# EAGLE design CANBUS_USB (EAGLE 9.1.3)
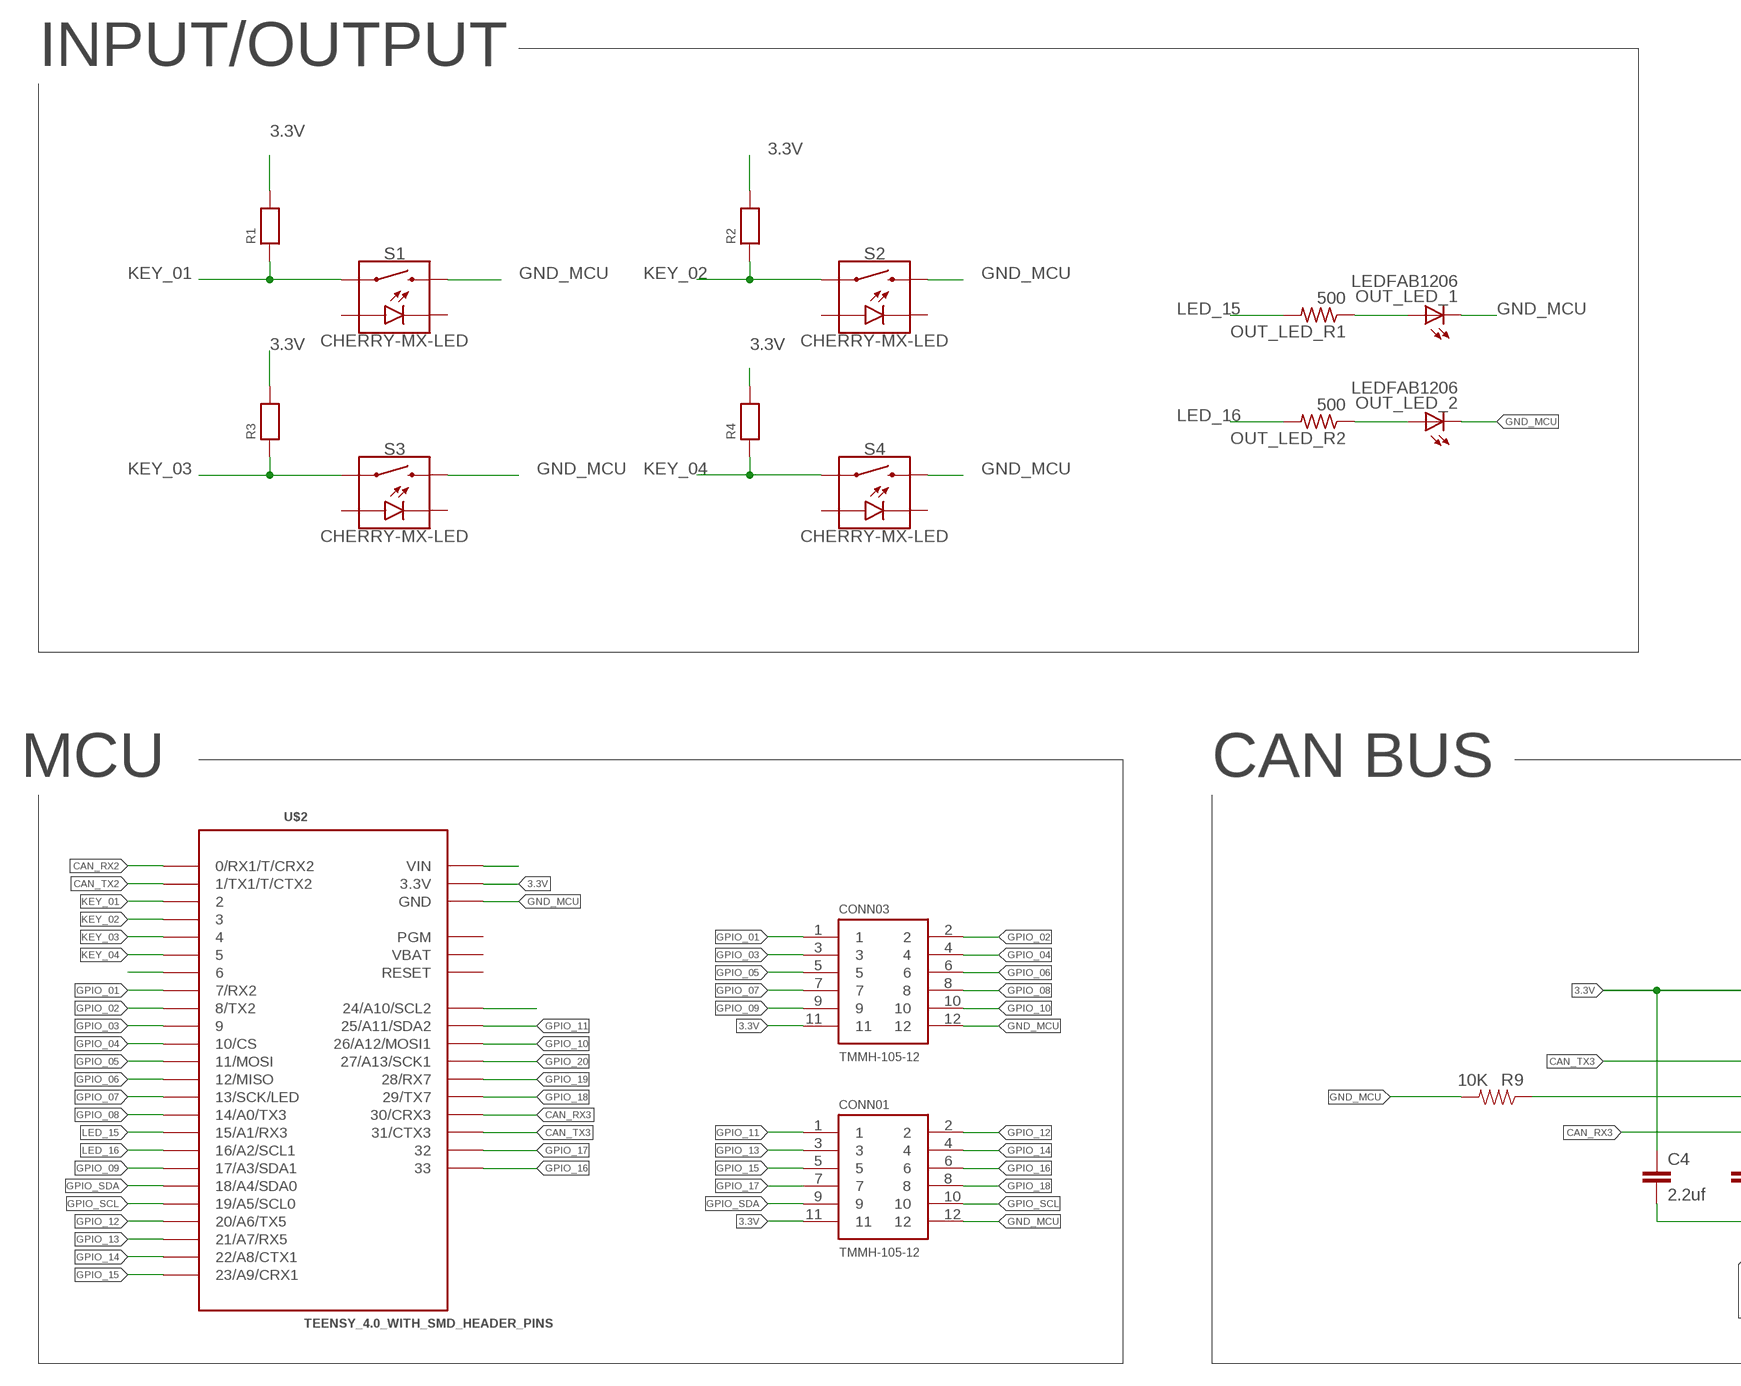
[diagram p0: schematic, sheet 1, part 1 of 2]
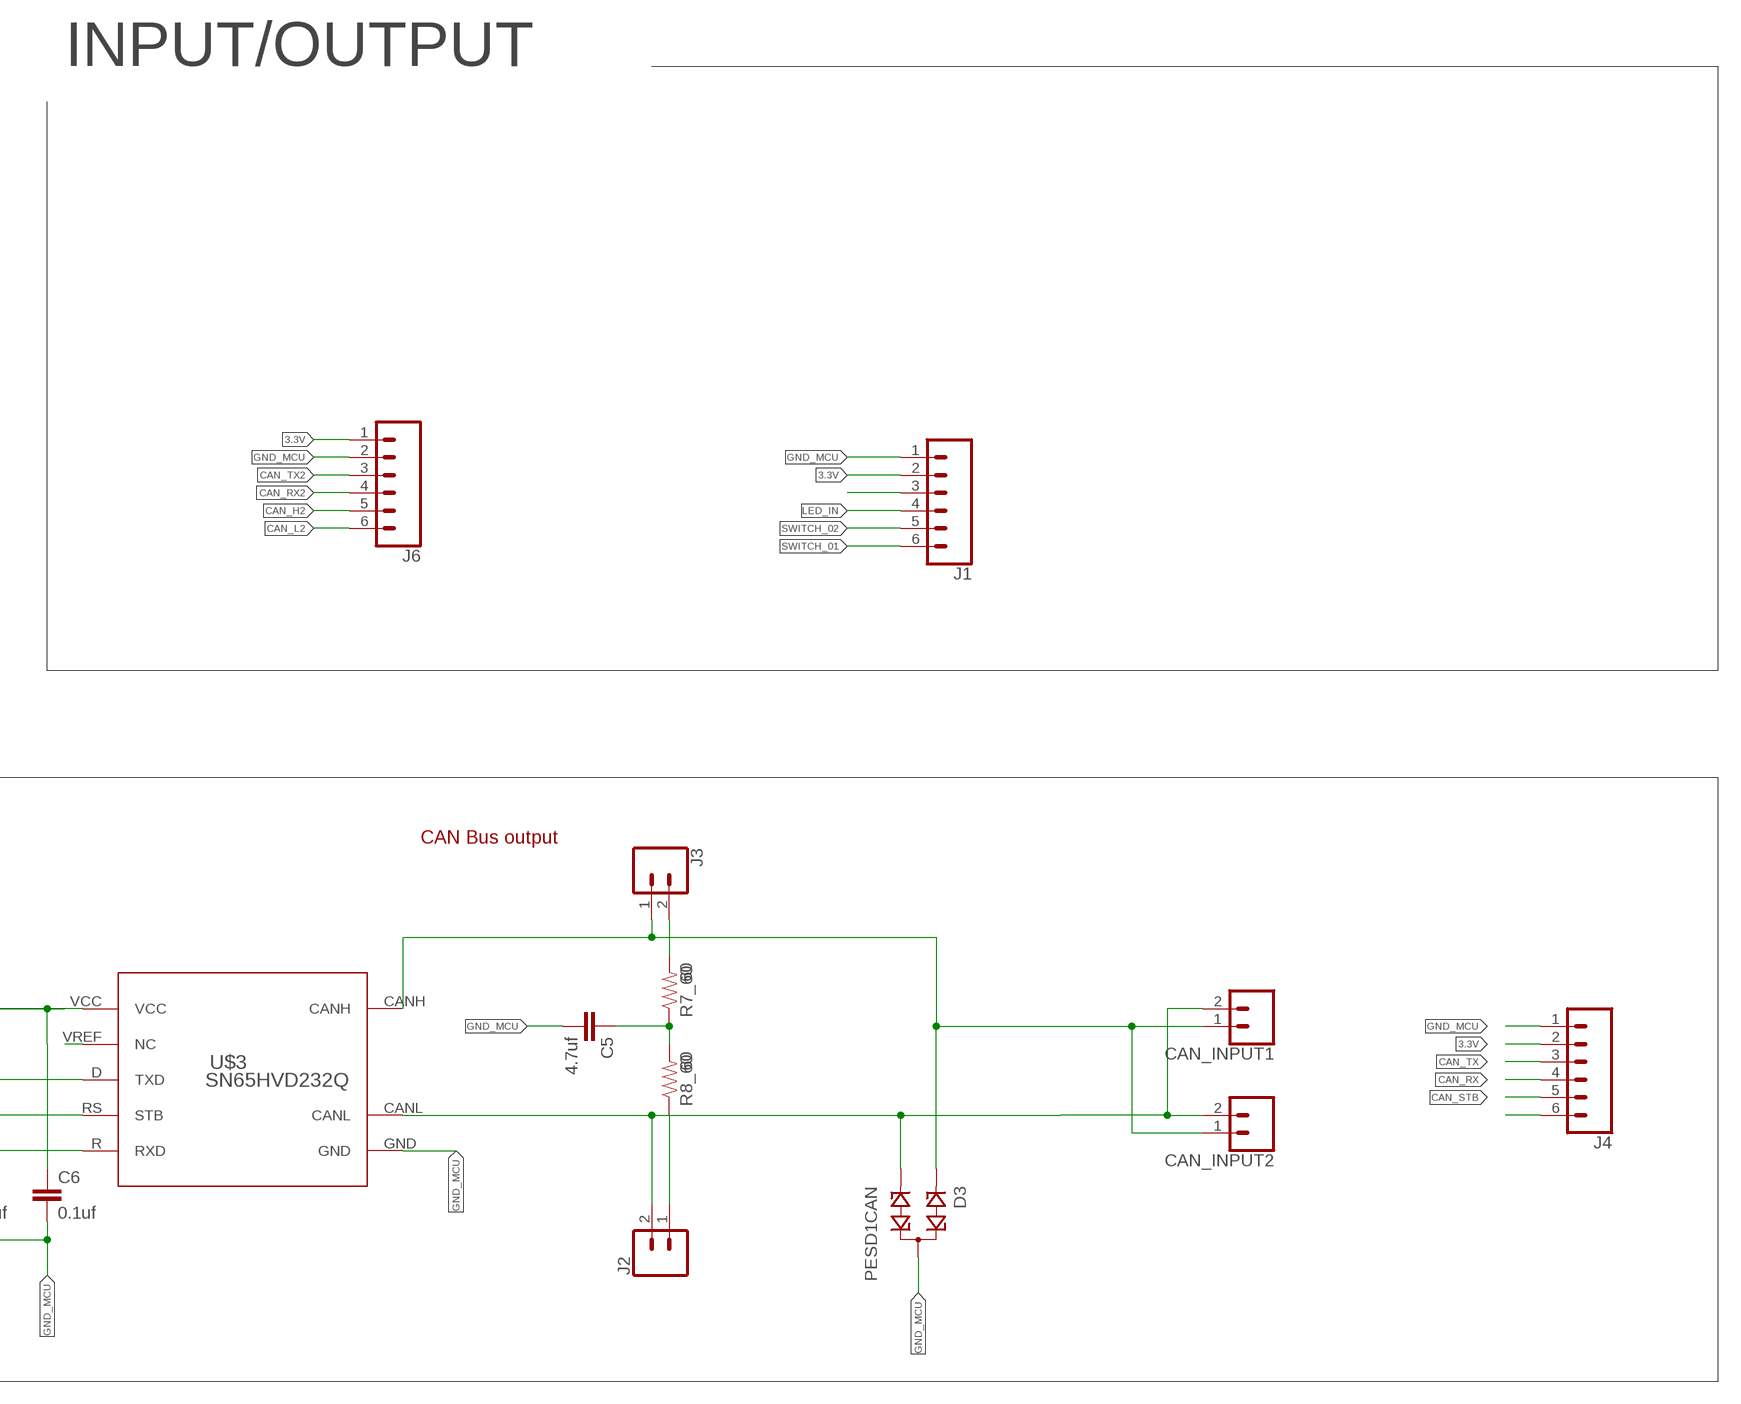
[diagram p1: schematic, sheet 1, part 2 of 2]

## Parts
C4  2.2uf  0.1UF-25V(+80/-20%)(0603)  [0603-CAP]
C5  4.7uf  0.1UF-25V(+80/-20%)(0603)  [0603-CAP]
C6  0.1uf  0.1UF-25V(+80/-20%)(0603)  [0603-CAP]
CAN_INPUT1  CONN_02-JST-2MM-SMT  [JST-2-SMD]
CAN_INPUT2  CONN_02-JST-2MM-SMT  [JST-2-SMD]
CONN01  TMMH-105-12  [TMMH-105-12]
CONN03  TMMH-105-12  [TMMH-105-12]
D3  PESD1CAN  [SOT23]
J1  CONN_06SMD-1MM  [1X06-1MM]
J2  CONN_02  [1X02]
J3  CONN_02  [1X02]
J4  CONN_06SMD-1MM  [1X06-1MM]
J6  CONN_06NO_SILK_NO_POP  [1X06_NO_SILK]
OUT_LED_1  LEDFAB1206  [LED1206FAB]
OUT_LED_2  LEDFAB1206  [LED1206FAB]
OUT_LED_R1  500  RES-US1206FAB  [R1206FAB]
OUT_LED_R2  500  RES-US1206FAB  [R1206FAB]
R1  RESISTOR1206  [1206]
R2  RESISTOR1206  [1206]
R3  RESISTOR1206  [1206]
R4  RESISTOR1206  [1206]
R7_60  60  10KOHM-1/10W-1%(0603)0603  [0603-RES]
R8_60  60  10KOHM-1/10W-1%(0603)0603  [0603-RES]
R9  10K  10KOHM-1/10W-1%(0603)0603  [0603-RES]
S1  CHERRY-MX-LED  [CHERRY-MX-LED]
S2  CHERRY-MX-LED  [CHERRY-MX-LED]
S3  CHERRY-MX-LED  [CHERRY-MX-LED]
S4  CHERRY-MX-LED  [CHERRY-MX-LED]
U$2  TEENSY_4.0_WITH_SMD_HEADER_PINS  [TEENSY_4.0_WITH_SMD_HEADER_PINS]
U$3  SN65HVD232Q  [SN65HVD232Q]

## Nets
3.3V: C4.1 C6.1 CONN01.11 CONN03.11 J1.2 J4.2 J6.1 R1.2 R2.2 R3.2 R4.2 U$2.3.3V U$2.3.3V1(3.3V) U$3.VCC
CAN_H1: CAN_INPUT1.1 CAN_INPUT2.1 D3.1 J3.1 U$3.CANH
CAN_H2: J6.5
CAN_L1: CAN_INPUT1.2 CAN_INPUT2.2 D3.2 J2.2 U$3.CANL
CAN_L2: J6.6
CAN_RX: J4.4
CAN_RX2: J6.4 U$2.0(0/RX1/T/CRX2)
CAN_RX3: U$2.30(30/CRX3) U$3.R(RXD)
CAN_STB: J4.5
CAN_TX: J1.3 J4.3
CAN_TX2: J6.3 U$2.1(1/TX1/T/CTX2)
CAN_TX3: U$2.31(31/CTX3) U$3.D(TXD)
GND_MCU: C4.2 C5.2 C6.2 CONN01.12 CONN03.12 D3.3 J1.1 J4.1 J6.2 OUT_LED_1.2(C) OUT_LED_2.2(C) R9.2 S1.S2 S2.S2 S3.S2 S4.S2 U$2.GND U$2.GND1(GND) U$2.GND2(GND) U$3.GND
GPIO_01: CONN03.1 U$2.7(7/RX2)
GPIO_02: CONN03.2 U$2.8(8/TX2)
GPIO_03: CONN03.3 U$2.9
GPIO_04: CONN03.4 U$2.10(10/CS)
GPIO_05: CONN03.5 U$2.11(11/MOSI)
GPIO_06: CONN03.6 U$2.12(12/MISO)
GPIO_07: CONN03.7 U$2.13(13/SCK/LED)
GPIO_08: CONN03.8 U$2.14/A0(14/A0/TX3)
GPIO_09: CONN03.9 U$2.17/A3(17/A3/SDA1)
GPIO_10: CONN03.10 U$2.26(26/A12/MOSI1)
GPIO_11: CONN01.1 U$2.25(25/A11/SDA2)
GPIO_12: CONN01.2 U$2.20/A6(20/A6/TX5)
GPIO_13: CONN01.3 U$2.21/A7(21/A7/RX5)
GPIO_14: CONN01.4 U$2.22/A8(22/A8/CTX1)
GPIO_15: CONN01.5 U$2.23/A9(23/A9/CRX1)
GPIO_16: CONN01.6 U$2.33
GPIO_17: CONN01.7 U$2.32
GPIO_18: CONN01.8 U$2.29(29/TX7)
GPIO_19: U$2.28(28/RX7)
GPIO_20: U$2.27(27/A13/SCK1)
GPIO_SCL: CONN01.10 U$2.19/A5(19/A5/SCL0)
GPIO_SDA: CONN01.9 U$2.18/A4(18/A4/SDA0)
KEY_01: R1.1 S1.S1 U$2.2
KEY_02: R2.1 S2.S1 U$2.3
KEY_03: R3.1 S3.S1 U$2.4
KEY_04: R4.1 S4.S1 U$2.5
LED_15: OUT_LED_R1.2 U$2.15/A1(15/A1/RX3)
LED_16: OUT_LED_R2.2 U$2.16/A2(16/A2/SCL1)
LED_IN: J1.4
N$1: OUT_LED_2.1(A) OUT_LED_R2.1
N$2: J4.6
N$3: U$2.VIN
N$4: OUT_LED_1.1(A) OUT_LED_R1.1
N$5: U$3.VREF(NC)
N$6: R9.1 U$3.RS(STB)
N$7: J3.2 R7_60.2
N$10: U$2.24(24/A10/SCL2)
N$13: C5.1 R7_60.1 R8_60.2
N$14: J2.1 R8_60.1
N$28: U$2.6
SWITCH_01: J1.6
SWITCH_02: J1.5
Unconnected: S1.A S1.K(C) S2.A S2.K(C) S3.A S3.K(C) S4.A S4.K(C) U$2.PGM U$2.RESET

## Notes on the sheet
- INPUT/OUTPUT | INPUT/OUTPUT
- MCU | CAN BUS
- CAN Bus output

## Power pins joined to a net without a drawn wire
VBAT: U$2.VBAT

## Library data of the parts
C4-C6 = SparkFun-Capacitors:0.1UF-25V(+80/-20%)(0603): CAP-00810 Ceramic Standard decoupling cap; PROD_ID: CAP-00810; VALUE: 0.1uF
CAN_INPUT1 CAN_INPUT2 = SparkFun-Connectors:CONN_02: Multi connection point. Often used as Generic Header-pin footprint for 0.1 inch spaced/style header connections On any of the 0.1 inch spaced packages, you can populate with these: Break Away Headers - Straight <https://www.sparkfun.com/products/116> (PRT-00116) Break Away Male Headers - Right Angle <https://www.sparkfun.com/products/553> (PRT-00553) Female Headers <https://www.sparkfun.com/products/115> (PRT-00115) Break Away Headers - Machine Pin <https://www.sparkfun.com/products/117> (PRT-00117) Break Away Female Headers - Swiss Machine Pin <https://www.sparkfun.com/products/743> (PRT-00743) For SCREWTERMINALS and SPRING TERMINALS visit here: Screw Terimnals on SparkFun.com <https://www.sparkfun.com/search/results?term=Screw+Terminals> (5mm/3.5mm/2.54mm spacing) This device is also useful as a general connection point to wire up your design to another part of your project. Our various solder wires solder well into these plated through hole pads. Hook-Up Wire - Assortment (Stranded, 22 AWG) <https://www.sparkfun.com/products/11375> (PRT-11375) Hook-Up Wire - Assortment (Solid Core, 22 AWG) <https://www.sparkfun.com/products/11367> (PRT-11367) View the entire wire category on our website here <https://www.sparkfun.com/categories/141> Special notes: Molex polarized connector foot print use with: PRT-08233 with associated crimp pins and housings. 2.54_SCREWTERM for use with PRT-10571. 3.5mm Screw Terminal footprints for PRT-08084 5mm Screw Terminal footprints for use with PRT-08432; PROD_ID: CONN-11443
CONN01 CONN03 = TMMH-105-XX-XX-DV:TMMH-105-12: 2mm (.0787") Flex Shroud, .020" (.51mm) Square Post Terminal Strip, Surface Mount,10 Pins.
D3 = diode:PESD1CAN: CAN bus ESD protection diode Source: http://www.nxp.com/documents/data_sheet/PESD1CAN.pdf
J1 J4 = SparkFun-Connectors:CONN_06: Multi connection point. Often used as Generic Header-pin footprint for 0.1 inch spaced/style header connections On any of the 0.1 inch spaced packages, you can populate with these: Break Away Headers - Straight <https://www.sparkfun.com/products/116> (PRT-00116) Break Away Male Headers - Right Angle <https://www.sparkfun.com/products/553> (PRT-00553) Female Headers <https://www.sparkfun.com/products/115> (PRT-00115) Break Away Headers - Machine Pin <https://www.sparkfun.com/products/117> (PRT-00117) Break Away Female Headers - Swiss Machine Pin <https://www.sparkfun.com/products/743> (PRT-00743) Arduino Stackable Header - 6 Pin <https://www.sparkfun.com/products/9280> (PRT-09280) For SCREWTERMINALS and SPRING TERMINALS visit here: Screw Terimnals on SparkFun.com <https://www.sparkfun.com/search/results?term=Screw+Terminals> (5mm/3.5mm/2.54mm spacing) This device is also useful as a general connection point to wire up your design to another part of your project. Our various solder wires solder well into these plated through hole pads. Hook-Up Wire - Assortment (Stranded, 22 AWG) <https://www.sparkfun.com/products/11375> (PRT-11375) Hook-Up Wire - Assortment (Solid Core, 22 AWG) <https://www.sparkfun.com/products/11367> (PRT-11367) View the entire wire category on our website here <https://www.sparkfun.com/categories/141>; PROD_ID: CONN-08249; SF_ID: GPS-00579
J2 J3 = SparkFun-Connectors:CONN_02: Multi connection point. Often used as Generic Header-pin footprint for 0.1 inch spaced/style header connections On any of the 0.1 inch spaced packages, you can populate with these: Break Away Headers - Straight <https://www.sparkfun.com/products/116> (PRT-00116) Break Away Male Headers - Right Angle <https://www.sparkfun.com/products/553> (PRT-00553) Female Headers <https://www.sparkfun.com/products/115> (PRT-00115) Break Away Headers - Machine Pin <https://www.sparkfun.com/products/117> (PRT-00117) Break Away Female Headers - Swiss Machine Pin <https://www.sparkfun.com/products/743> (PRT-00743) For SCREWTERMINALS and SPRING TERMINALS visit here: Screw Terimnals on SparkFun.com <https://www.sparkfun.com/search/results?term=Screw+Terminals> (5mm/3.5mm/2.54mm spacing) This device is also useful as a general connection point to wire up your design to another part of your project. Our various solder wires solder well into these plated through hole pads. Hook-Up Wire - Assortment (Stranded, 22 AWG) <https://www.sparkfun.com/products/11375> (PRT-11375) Hook-Up Wire - Assortment (Solid Core, 22 AWG) <https://www.sparkfun.com/products/11367> (PRT-11367) View the entire wire category on our website here <https://www.sparkfun.com/categories/141> Special notes: Molex polarized connector foot print use with: PRT-08233 with associated crimp pins and housings. 2.54_SCREWTERM for use with PRT-10571. 3.5mm Screw Terminal footprints for PRT-08084 5mm Screw Terminal footprints for use with PRT-08432
J6 = SparkFun-Connectors:CONN_06: Multi connection point. Often used as Generic Header-pin footprint for 0.1 inch spaced/style header connections On any of the 0.1 inch spaced packages, you can populate with these: Break Away Headers - Straight <https://www.sparkfun.com/products/116> (PRT-00116) Break Away Male Headers - Right Angle <https://www.sparkfun.com/products/553> (PRT-00553) Female Headers <https://www.sparkfun.com/products/115> (PRT-00115) Break Away Headers - Machine Pin <https://www.sparkfun.com/products/117> (PRT-00117) Break Away Female Headers - Swiss Machine Pin <https://www.sparkfun.com/products/743> (PRT-00743) Arduino Stackable Header - 6 Pin <https://www.sparkfun.com/products/9280> (PRT-09280) For SCREWTERMINALS and SPRING TERMINALS visit here: Screw Terimnals on SparkFun.com <https://www.sparkfun.com/search/results?term=Screw+Terminals> (5mm/3.5mm/2.54mm spacing) This device is also useful as a general connection point to wire up your design to another part of your project. Our various solder wires solder well into these plated through hole pads. Hook-Up Wire - Assortment (Stranded, 22 AWG) <https://www.sparkfun.com/products/11375> (PRT-11375) Hook-Up Wire - Assortment (Solid Core, 22 AWG) <https://www.sparkfun.com/products/11367> (PRT-11367) View the entire wire category on our website here <https://www.sparkfun.com/categories/141>
OUT_LED_1 OUT_LED_2 = fab:LED: LED
OUT_LED_R1 OUT_LED_R2 = fab:RES-US: Resistor (US Symbol) Variants with postfix FAB are widened to allow the routing of internal traces
R1-R4 = microbuilder:RESISTOR: Resistors 0402 - 0402 Surface Mount Package 22 Ohm 1% 1/16W [Digikey: 311-22.0LRTR-ND] 33 Ohm 5% 1/16W 1.0K 5% 1/16W 1.5K 5% 1/16W 2.0K 1% 1/16W 10.0K 1% 1/16W [Digikey: 311-10.0KLRTR-ND] 10.0K 5% 1/16W [Digikey: RMCF0402JT10K0TR-ND] 12.1K 1% 1/16W [Digikey: 311-22.0LRTR-ND] 100.0K 5% 1/16W 0603 - 0603 Surface Mount Package 0 Ohm 1/10 Watt 1% Resistor 15 Ohm 1/10 Watt 1% Resistor 33 Ohm 1/10 Watt 1% Resistor 49.9 Ohm 1/10 Watt 1% Resistor 100 Ohm 1/10 Watt 1% Resistor 150 Ohm 1/10 Watt 1% Resistor 240 Ohm 1/10 Watt 1% Resistor 390 Ohm 1/10 Watt 1% Resistor 560 Ohm 1/10 Watt 1% Resistor 680 Ohm 1/10 Watt 1% Resistor 750 Ohm 1/10 Watt 1% Resistor 1.0K Ohm 1/10 Watt 1% Resistor 1.5K Ohm 1/10 Watt 1% Resistor 2.0K Ohm 1/10 Watt 1% Resistor 2.2K Ohm 1/10 Watt 1% Resistor 3.3K Ohm 1/10 Watt 1% Resistor 4.7K Ohm 1/10 Watt 1% Resistor 10.0K Ohm 1/10 Watt 1% Resistor 12.0K Ohm 1/10 Watt 1% Resistor 12.1K Ohm 1/10 Watt 1% Resistor 20.0K Ohm 1/10 Watt 1% Resistor 33.0K Ohm 1/10 Watt 1% Resistor 100.0K Ohm 1/10 Watt 1% Resistor 0805 - 0805 Surface Mount Package 0 Ohm 1/8 Watt 1% Resistor 33 Ohm 1/8 Watt 1% Resistor 100 Ohm 1/8 Watt 1% Resistor 150 Ohm 1/8 Watt 1% Resistor 200 Ohm 1/8 Watt 1% Resistor 240 Ohm 1/8 Watt 1% Resistor 330 Ohm 1/8 Watt 1% Resistor 390 Ohm 1/8 Watt 1% Resistor 470 Ohm 1/8 Watt 1% Resistor 1.0K Ohm 1/8 Watt 1% Resistor 1.5K Ohm 1/8 Watt 1% Resistor 2.0K Ohm 1/8 Watt 1% Resistor 4.7K Ohm 1/8 Watt 1% Resistor 5.1K Ohm 1/8 Watt 1% Resistor 5.6K Ohm 1/8 Watt 1% Resistor 10.0K Ohm 1/8 Watt 1% Resistor 22.0K Ohm 1/8 Watt 1% Resistor 33.0K Ohm 1/8 Watt 1% Resistor 100K Ohm 1/8 Watt 1% Resistor 1206 - 1206 Surface Mount Package 2012 - 2010 Surface Mount Package 0.11 Ohm 1/2 Watt 1% Resistor - Digikey: RHM.11UCT-ND
R7_60 R8_60 = SparkFun-Resistors:10KOHM-1/10W-1%(0603): RES-00824; PROD_ID: RES-00824; VALUE: 10K
R9 = SparkFun-Resistors:10KOHM-1/10W-1%(0603): RES-00824; PROD_ID: RES-00824
S1-S4 = cherry-temp:CHERRY-MX-LED
U$2 = Teensy4:TEENSY_4.0_WITH_SMD_HEADER_PINS: Footprint for Teensy 3.1 or 3.2 board using all pin connections on the outer perimeter
U$3 = TCAN1042DRQ1:SN65HVD232Q

## Net classes
0 default: width 0.2 mm, clearance 0.2 mm
1 gnd: width 0.2 mm, clearance 0.2 mm
3 vcc: width 0.2 mm, clearance 0.2 mm

## Board
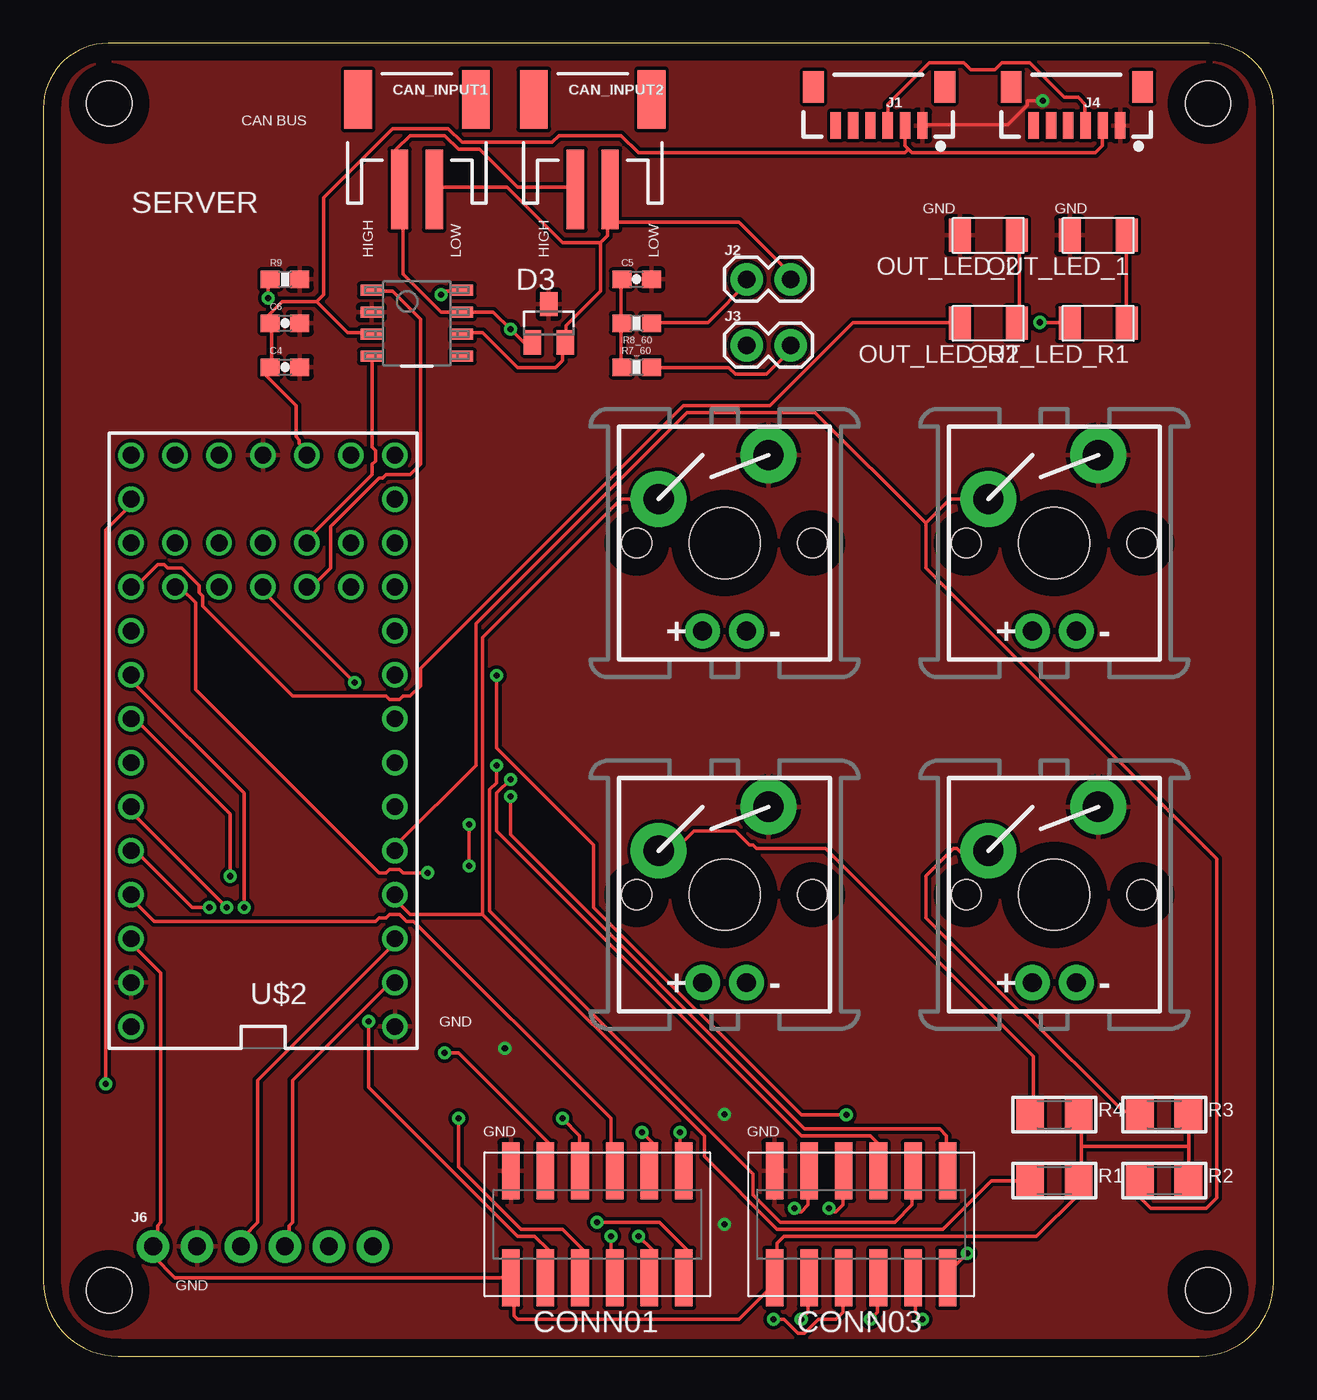
[diagram p2: board, top side]
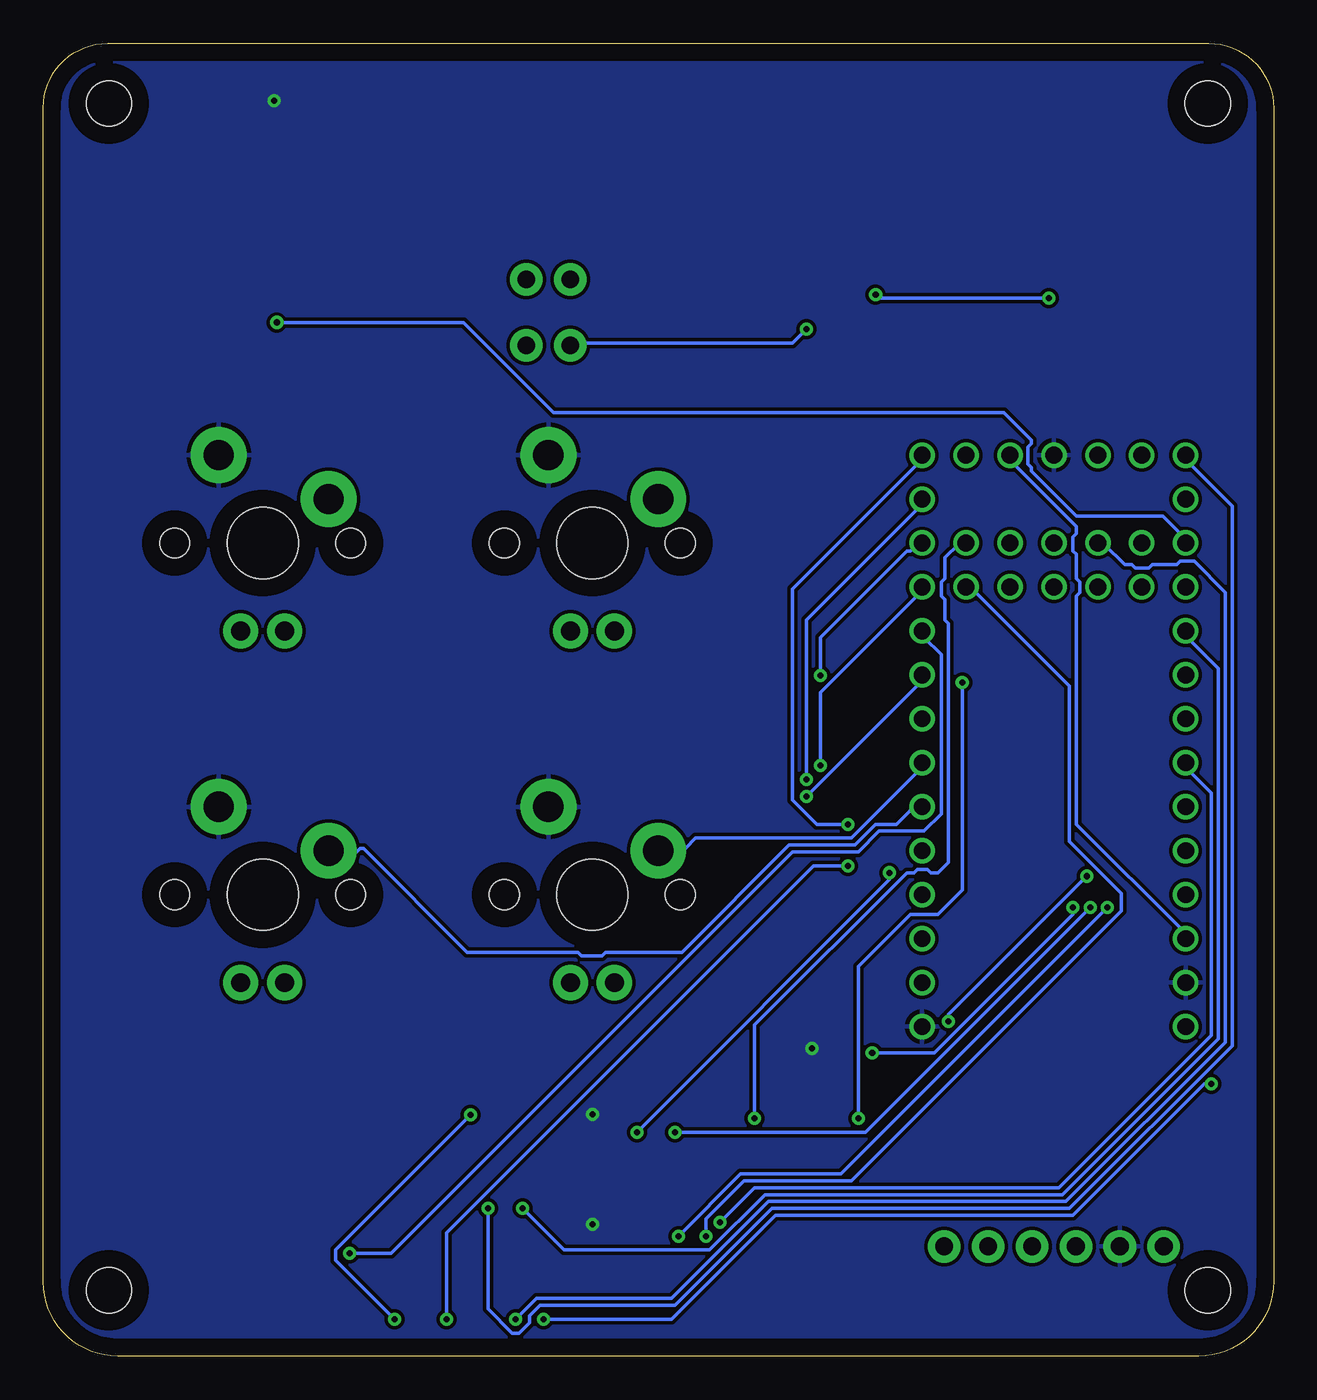
[diagram p3: board, bottom side, seen from below]

Size 71.1 x 75.87 mm. Coordinates in mm from the lower left corner, seen from the top.
Outline: 0,72.12 0,4.34 arc90 4.34,0 66.8,0 arc90 71.1,4.3 71.1,72.15 arc90 67.38,75.87 3.75,75.87 arc90 0,72.12
Copper layers (1*16): Top 0.035mm / dielectric 1.5mm / Bottom 0.035mm
Design rules "default": minimum track width 6mil, minimum drill 0.35mm, track to track 6mil, track to pad 6mil, pad to pad 6mil, via to via 6mil, smd to smd 6mil, copper to edge 40mil, drill to drill 6mil, minimum pad ring 10mil, minimum via ring 8mil, stop-mask expansion 4mil, vias tented up to drill 0mil, thermal gap 10mil
Holes 2.6 mm at 3.81,72.39 67.31,72.39 3.81,3.81 67.31,3.81

### Footprints (pad centres in the part's own frame; a part is rotated, then mirrored left to right if it is on the bottom)
0603-CAP = smd 1.1 x 1: 1 -0.85,0; 2 0.85,0
JST-2-SMD = smd 1 x 4.6: 1 -1,-3.7; 2 1,-3.7 | smd 1.6 x 3.4: NC1 -3.4,1.5; NC2 3.4,1.5
TMMH-105-12 = smd 1.016 x 3.302: 1 -5.27,-3.086; 2 -5.27,3.086; 3 -3.27,-3.086; 4 -3.27,3.086; 5 -1.27,-3.086; 6 -1.27,3.086; 7 0.73,-3.086; 8 0.73,3.086; 9 2.73,-3.086; 10 2.73,3.086; 11 4.73,3.086; 12 4.73,-3.086
SOT23 = smd 1 x 1.4: 1 -0.95,-1.1; 2 0.95,-1.1; 3 0,1.1
1X06-1MM = smd 0.6 x 1.55: 1 -2.54,1.27; 2 -1.54,1.27; 3 -0.54,1.27; 4 0.46,1.27; 5 1.46,1.27; 6 2.46,1.27 | smd 1.2 x 1.8: P$1 -3.84,-0.955; P$2 3.76,-0.955
1X02 = drill 1.016 pad 1.88: 1 0,0; 2 2.54,0
1X06_NO_SILK = drill 1.016 pad 1.88: 1 0,0; 2 2.54,0; 3 5.08,0; 4 7.62,0; 5 10.16,0; 6 12.7,0
LED1206FAB = smd 1.27 x 1.905: 1 -1.651,0; 2 1.651,0
R1206FAB = smd 1.27 x 1.905: 1 -1.651,0; 2 1.651,0
1206 = smd 1.6 x 1.8: 1 -1.4,0; 2 1.4,0
0603-RES = smd 1.1 x 1: 1 -0.85,0; 2 0.85,0
CHERRY-MX-LED = drill 1.092 pad 2.032: A -1.27,-5.08; K 1.27,-5.08 | drill 1.753 pad 3.226: S1 -3.81,2.54; S2 2.54,5.08 | hole 4.089: 0,0 | hole 1.707: -5.08,0; 5.08,0
TEENSY_4.0_WITH_SMD_HEADER_PINS = drill 0.965: 0 -7.62,13.97; 1 -7.62,11.43; 2 -7.62,8.89; 3 -7.62,6.35; 3.3V 7.62,11.43; 3.3V1 -2.54,-16.51; 4 -7.62,3.81; 5 -7.62,1.27; 6 -7.62,-1.27; 7 -7.62,-3.81; 8 -7.62,-6.35; 9 -7.62,-8.89; 10 -7.62,-11.43; 11 -7.62,-13.97; 12 -7.62,-16.51; 13 7.62,-16.51; 14/A0 7.62,-13.97; 15/A1 7.62,-11.43; 16/A2 7.62,-8.89; 17/A3 7.62,-6.35; 18/A4 7.62,-3.81; 19/A5 7.62,-1.27; 20/A6 7.62,1.27; 21/A7 7.62,3.81; 22/A8 7.62,6.35; 23/A9 7.62,8.89; 24 5.08,-11.43; 25 5.08,-8.89; 26 2.54,-11.43; 27 2.54,-8.89; 28 0,-11.43; 29 0,-8.89; 30 -2.54,-11.43; 31 -2.54,-8.89; 32 -5.08,-11.43; 33 -5.08,-8.89; GND -7.62,16.51; GND1 0,-16.51; GND2 7.62,13.97; PGM 2.54,-16.51; RESET 5.08,-16.51; VBAT -5.08,-16.51; VIN 7.62,16.51
SN65HVD232Q = smd 1.27 x 0.635: CANH 2.625,0.635; CANL 2.625,-0.635; D -2.625,1.905; GND -2.625,0.635; R -2.625,-1.905; RS 2.625,1.905; VCC -2.625,-0.635; VREF 2.625,-1.905

### Placement (x,y rotation side)
C4  13.97,57.15 0 top
C5  34.29,62.23 0 top
C6  13.97,59.69 0 top
CAN_INPUT1  21.59,71.12 0 top
CAN_INPUT2  31.75,71.12 0 top
CONN01  31.75,7.62 180 top
CONN03  46.99,7.62 180 top
D3  29.21,59.69 0 top
J1  48.26,72.39 180 top
J2  40.64,62.23 0 top
J3  40.64,58.42 0 top
J4  59.69,72.39 180 top
J6  6.35,6.35 0 top
OUT_LED_1  60.96,64.77 180 top
OUT_LED_2  54.61,64.77 180 top
OUT_LED_R1  60.96,59.69 180 top
OUT_LED_R2  54.61,59.69 180 top
R1  58.42,10.16 0 top
R2  64.77,10.16 0 top
R3  64.77,13.97 0 top
R4  58.42,13.97 0 top
R7_60  34.29,57.15 0 top
R8_60  34.29,59.69 180 top
R9  13.97,62.23 0 top
S1  39.37,46.99 0 top
S2  58.42,46.99 0 top
S3  58.42,26.67 0 top
S4  39.37,26.67 0 top
U$2  12.7,35.56 180 top
U$3  21.59,59.69 0 top

### Tracks (layer width: path | path; a pad name or v marks a point on that pad's centre or on a via)
3.3V
  Top 0.2: 50,69.74 50.2,69.54 60.8,69.54 61.2,69.94 61.2,70.94 J4.2 | 50,69.74 49.8,69.94 49.8,70.94 J1.2 | 15.8,60.94 17.6,59.14 18.8,59.14 U$3.VCC | 15.8,60.94 13.8,60.94 13,60.14 13,59.74 C6.1 13.2,59.54 13.2,57.34 C4.1 13,57.14 12.8,56.94 12.8,56.74 14.6,54.94 14.6,53.14 14.8,52.94 14.8,52.74 15.2,52.34 15.2,52.14 U$2.3.3V1 | 50,69.74 49.8,69.54 34.4,69.54 33.4,70.54 29.8,70.54 29.4,70.14 24.2,70.14 23.4,70.94 20.2,70.94 16.2,66.94 16.2,61.34 15.8,60.94 | U$2.3.3V 5.2,23.94 5.2,23.74 6.8,22.14 6.8,7.74 6.6,7.54 6.6,6.74 6.4,6.54 J6.1 6.4,6.34 6.4,5.74 7.6,4.54 27,4.54 CONN01.11 27.2,4.34 27.2,2.34 27.4,2.14 40.2,2.14 42.4,4.34 CONN03.11 42.4,4.54 42.4,6.54 42.8,6.94 57.4,6.94 59.8,9.34 59.8,10.14 R1.2 60,10.34 60,12.14 | 60,12.14 60,13.94 R4.2 | 66.2,12.14 66.2,13.94 R3.2 | 66.2,12.14 66.2,10.34 R2.2 | 66.2,12.14 60,12.14
  Bottom 0.2: U$2.3.3V1 15.2,51.94 15.2,51.74 11.4,47.94 11.4,47.54 11.6,47.34 11.6,46.54 11.4,46.34 11.4,44.94 11.2,44.74 11.2,44.14 11.4,43.94 11.4,30.74 5.2,24.54 5.2,24.14 U$2.3.3V
CAN_H1  (via drill 0.35)
  Top 0.2: D3.1 28.2,58.54 27.8,58.54 v27,59.34 26,60.34 24.4,60.34 U$3.CANH 24.2,60.34 23,60.34 20.8,62.54 20.8,67.14 20.6,67.34 CAN_INPUT1.1 20.4,67.54 20.4,69.74 21.2,70.54 23.2,70.54 24,69.74 25.2,69.74 27.4,67.54 30.6,67.54 CAN_INPUT2.1
  Bottom 0.2: v27,59.34 27.8,58.54 40.6,58.54 J3.1
CAN_L1
  Top 0.2: U$3.CANL 24.4,59.14 25.4,59.14 27.4,57.14 29.6,57.14 30,57.54 30,58.54 D3.2 30.2,58.74 30.2,59.54 32.2,61.54 32.2,64.34 | 32.2,64.34 32.6,64.74 32.6,65.54 | 32.6,65.54 32.6,67.34 CAN_INPUT2.2 32.6,65.54 | 32.6,65.54 40.2,65.54 43,62.74 43,62.34 J2.2 | 32.2,64.34 30,64.34 26.8,67.54 22.6,67.54 CAN_INPUT1.2
CAN_RX2
  Top 0.2: U$2.0 20.2,21.54 20,21.54 14.4,15.94 14.4,7.74 14.2,7.54 14.2,6.74 14,6.54 J6.4
CAN_RX3
  Top 0.2: U$3.R 19,57.74 19,52.54 19.2,52.34 19.2,51.74 19,51.54 19,50.94 15.2,47.14 U$2.30
CAN_TX
  Top 0.2: J1.3 48.8,71.14 48.8,72.34 51.2,74.74 53.2,74.74 53.6,74.34 55,74.34 55.4,74.74 57,74.74 59,72.74 59.8,72.74 60.2,72.34 60.2,71.14 J4.3
CAN_TX2
  Top 0.2: U$2.1 20.2,23.94 20.2,23.74 12.4,15.94 12.4,7.74 11.6,6.94 11.6,6.54 J6.3
CAN_TX3
  Top 0.2: U$3.D 19,61.54 20.2,61.54 21.8,59.94 21.8,51.54 21.2,50.94 19.8,50.94 19.6,50.74 19.4,50.74 16.6,47.94 16.6,45.54 15.4,44.34 U$2.31
GND_MCU  (via drill 0.35)
  Top 0.2: v57.75,72.54 56.88,72.54 56.88,72.29 55.75,71.17 50.88,71.17 J1.1
  other vias: 26.67,17.78 39.37,7.62 39.37,13.97
  pour Top: -58.42,80.01 119.38,80.01 119.38,-6.35 -58.42,-6.35
  pour Bottom: -43.92,83.82 132.61,83.82 132.61,-92.71 arc-90
GPIO_01  (via drill 0.35)
  Top 0.2: v27,32.34 27,30.14 44,13.14 51.8,13.14 52.2,12.74 52.2,10.74 CONN03.1
  Bottom 0.2: v27,32.34 20.4,38.94 20.4,39.34 U$2.7
GPIO_02  (via drill 0.35)
  Top 0.2: v53.4,5.94 52.4,4.94 52.4,4.54 CONN03.2
  Bottom 0.2: v53.4,5.94 51,5.94 27.8,29.14 24,29.14 22.8,30.34 20.2,30.34 19.2,31.34 19.2,40.54 20.2,41.54 20.2,41.74 U$2.8
GPIO_03  (via drill 0.35)
  Top 0.2: v26.2,34.14 26.2,33.14 25.8,32.74 25.8,25.74 41,10.54 41,9.34 42.6,7.74 49.2,7.74 50.2,8.74 50.2,10.54 CONN03.3
  Bottom 0.2: v26.2,34.14 26.2,38.34 20.4,44.14 20.4,44.34 U$2.9
GPIO_04  (via drill 0.35)
  Top 0.2: v26.2,39.34 26.2,35.14 31.8,29.54 31.8,25.94 43.8,13.94 v46.4,13.94 | v50.8,2.14 50.4,2.54 50.4,4.34 CONN03.4
  Bottom 0.2: v26.2,39.34 26.2,41.54 21.2,46.54 21,46.54 20.6,46.94 20.4,46.94 U$2.10 | v46.4,13.94 54.2,6.14 54.2,5.54 v50.8,2.14
GPIO_05  (via drill 0.35)
  Top 0.2: v27,33.34 26.2,32.54 26.2,30.34 43.8,12.74 47.8,12.74 48.2,12.34 48.2,10.74 CONN03.5
  Bottom 0.2: v27,33.34 27,42.54 20.4,49.14 20.4,49.34 U$2.11
GPIO_06  (via drill 0.35)
  Top 0.2: v24.6,28.34 v24.6,30.74 | v47.8,2.14 48.2,2.54 48.2,4.34 CONN03.6
  Bottom 0.2: v24.6,30.74 26.4,30.74 27.8,32.14 27.8,44.34 20.4,51.74 20.4,51.94 U$2.12 | v24.6,28.34 26.6,28.34 47.8,7.14 v47.8,2.14
GPIO_07  (via drill 0.35)
  Top 0.2: v45.4,8.54 45.6,8.34 45.8,8.34 46.2,8.74 46.2,10.54 CONN03.7
  Bottom 0.2: v45.4,8.54 45.4,2.74 44,1.34 43.6,1.34 43,1.94 43,2.34 42.4,2.94 34.6,2.94 29,8.54 11.8,8.54 2.4,17.94 2.4,49.14 5,51.74 5,51.94 U$2.13
GPIO_08  (via drill 0.35)
  Top 0.2: v3.6,15.74 3.6,47.74 5,49.14 5,49.34 U$2.14/A0 | v42.2,2.14 42.8,2.14 43.6,1.34 44,1.34 44.8,2.14 45.8,2.14 46.2,2.54 46.2,4.34 CONN03.8
  Bottom 0.2: v3.6,15.74 4,15.74 11.6,8.14 28.8,8.14 34.8,2.14 v42.2,2.14
GPIO_09  (via drill 0.35)
  Top 0.2: v43.4,8.54 43.6,8.34 43.8,8.34 44.2,8.74 44.2,10.54 CONN03.9
  Bottom 0.2: v43.4,8.54 41,6.14 32.6,6.14 29.4,9.34 12.2,9.34 3.2,18.34 3.2,39.74 5,41.54 5,41.74 U$2.17/A3
GPIO_10  (via drill 0.35)
  Top 0.2: v43.8,2.14 44.2,2.54 44.2,4.34 CONN03.10
  Bottom 0.2: v43.8,2.14 42.6,3.34 34.8,3.34 29.2,8.94 12,8.94 2.8,18.14 2.8,44.14 4.6,45.94 5.4,45.94 5.6,45.74 7,45.74 7.2,45.54 8,45.54 8.2,45.74 8.6,45.74 9.8,46.94 10,46.94 U$2.26
GPIO_11  (via drill 0.35)
  Top 0.2: v22.2,27.94 20.8,27.94 20.6,28.14 20,28.14 19.8,27.94 19.4,27.94 8.8,38.54 8.8,43.54 8,44.34 7.8,44.34 U$2.25 | v36.8,12.94 36.8,10.94 37,10.74 CONN01.1
  Bottom 0.2: v22.2,27.94 22.2,27.54 v36.8,12.94
GPIO_12  (via drill 0.35)
  Top 0.2: v32,7.74 35.6,7.74 37.2,6.14 37.2,4.54 CONN01.2
  Bottom 0.2: v32,7.74 30,9.74 12.4,9.74 3.6,18.54 3.6,32.54 5,33.94 5,34.14 U$2.20/A6
GPIO_13  (via drill 0.35)
  Top 0.2: v10.6,25.94 5.2,31.34 5.2,31.74 U$2.21/A7 | v34.6,12.94 35.2,12.34 35.2,10.74 CONN01.3
  Bottom 0.2: v10.6,25.94 23.6,12.94 v34.6,12.94
GPIO_14  (via drill 0.35)
  Top 0.2: v9.6,25.94 8.6,25.94 5.4,29.14 5.2,29.14 U$2.22/A8 | v34.4,6.94 35.2,6.14 35.2,4.54 CONN01.4
  Bottom 0.2: v9.6,25.94 25,10.54 30.8,10.54 v34.4,6.94
GPIO_15
  Top 0.2: U$2.23/A9 5.2,26.54 5.2,26.34 6.4,25.14 19.2,25.14 19.4,25.34 19.8,25.34 20,25.54 20.6,25.54 21,25.14 21.4,25.14 32.8,13.74 32.8,10.94 33,10.74 CONN01.5
GPIO_16  (via drill 0.35)
  Top 0.2: v32.8,6.94 32.8,4.74 33,4.54 CONN01.6
  Bottom 0.2: v32.8,6.94 32.8,7.94 30.6,10.14 24.4,10.14 8.8,25.74 8.8,26.74 11.8,29.74 11.8,38.74 17.4,44.34 17.6,44.34 U$2.33
GPIO_17  (via drill 0.35)
  Top 0.2: v30,13.74 31,12.74 31,10.74 CONN01.7
  Bottom 0.2: v30,13.74 30,19.14 21.2,27.94 20.8,27.94 20.6,28.14 20,28.14 19.8,27.94 19.4,27.94 18.8,28.54 18.8,42.34 19,42.54 19,43.74 19.2,43.94 19.2,44.74 19,44.94 19,46.14 18.2,46.94 17.8,46.94 U$2.32
GPIO_18  (via drill 0.35)
  Top 0.2: v18,38.94 12.8,44.14 12.8,44.34 U$2.29 | v24,13.74 24,10.94 27.6,7.34 30,7.34 31.2,6.14 31.2,4.54 CONN01.8
  Bottom 0.2: v18,38.94 18,26.94 19.4,25.54 21,25.54 24,22.54 v24,13.74
GPIO_SCL  (via drill 0.35)
  Top 0.2: v10.8,27.74 10.8,31.34 5.4,36.74 5.2,36.74 U$2.19/A5 | v18.8,19.34 18.8,15.54 27.4,6.94 28.4,6.94 29.2,6.14 29.2,4.54 CONN01.10
  Bottom 0.2: v10.8,27.74 18.8,19.74 v18.8,19.34
GPIO_SDA  (via drill 0.35)
  Top 0.2: v11.6,25.94 11.6,32.54 5.2,38.94 5.2,39.34 U$2.18/A4 | v23.2,17.54 24,17.54 29.2,12.34 29.2,10.74 CONN01.9
  Bottom 0.2: v11.6,25.94 11.6,25.54 19.6,17.54 v23.2,17.54
KEY_01
  Top 0.2: 25.4,25.54 38.2,12.74 38.2,11.54 42.4,7.34 52,7.34 54.8,10.14 57,10.14 R1.1 | 25.4,25.54 21.2,25.54 20.2,26.54 U$2.2 | 25.4,25.54 25.4,41.54 33.4,49.54 35.4,49.54 S1.S1
KEY_02
  Top 0.2: 51,48.14 51,45.54 67.8,28.74 67.8,9.14 67.2,8.54 64,8.54 63.4,9.14 63.4,10.14 R2.1 | 51,48.14 52.4,49.54 S2.S1 | 51,48.14 44.6,54.54 37.2,54.54 25,42.34 25,34.14 20.4,29.54 20.4,29.34 U$2.3
KEY_03
  Top 0.2: R3.1 63.2,14.14 62.4,14.14 56.6,19.94 56.4,19.94 51,25.34 51,27.74 52.6,29.34 52.8,29.34 53,29.14 54.6,29.14 S3.S1
  Bottom 0.2: U$2.4 20.4,31.74 20.8,31.74 21.8,30.74 23,30.74 24.2,29.54 28,29.54 34.2,23.34 38.6,23.34 38.8,23.14 40,23.14 40.2,23.34 46.6,23.34 52.6,29.34 52.8,29.34 53,29.14 54.6,29.14 S3.S1
KEY_04
  Top 0.2: R4.1 57.2,14.14 57.2,17.34 45.2,29.34 41.2,29.34 41,29.54 40.8,29.54 40,30.34 37.6,30.34 36.6,29.34 35.6,29.34 S4.S1
  Bottom 0.2: U$2.5 20.4,34.14 20.4,33.94 24.4,29.94 33.4,29.94 34,29.34 35.4,29.34 S4.S1
LED_15  (via drill 0.35)
  Top 0.2: v57.6,59.74 59.2,59.74 OUT_LED_R1.2
  Bottom 0.2: v57.6,59.74 46.8,59.74 41.6,54.54 15.6,54.54 14,52.94 14,52.74 14.2,52.54 14.2,51.54 14,51.34 14,51.14 11.4,48.54 6.4,48.54 5,47.14 U$2.15/A1
LED_16
  Top 0.2: OUT_LED_R2.2 52.8,59.74 46.8,59.74 42,54.94 37,54.94 21.8,39.74 21.8,38.74 21.2,38.14 20.8,38.14 20.6,37.94 20,37.94 19.8,38.14 14.4,38.14 9.2,43.34 9.2,43.94 9,44.14 9,44.54 8,45.54 7.2,45.54 7,45.74 6.6,45.74 5.2,44.34 U$2.16/A2
N$1
  Top 0.2: OUT_LED_R2.1 56.4,59.74 56.4,64.74 OUT_LED_2.1
N$4
  Top 0.2: OUT_LED_R1.1 62.6,59.74 62.6,64.74 OUT_LED_1.1
N$6  (via drill 0.35)
  Top 0.2: v13,61.14 13,62.14 R9.1 | v23,61.34 23.2,61.54 24.2,61.54 U$3.RS
  Bottom 0.2: v13,61.14 22.8,61.14 v23,61.34
N$7
  Top 0.2: R7_60.2 35.2,57.14 39.6,57.14 40,56.74 41.8,56.74 43,57.94 43,58.34 J3.2
N$13
  Top 0.2: R7_60.1 33.4,57.34 33.4,59.54 R8_60.2 33.4,59.74 33.4,62.14 C5.1
N$14
  Top 0.2: R8_60.1 35.2,59.74 38.4,59.74 40.8,62.14 J2.1

### Text on the board
tPlace: CAN BUS | SERVER | GND | GND | HIGH | LOW | HIGH | LOW | GND | GND | GND | GND